# Altium project Assembly Guide.PrjPCB
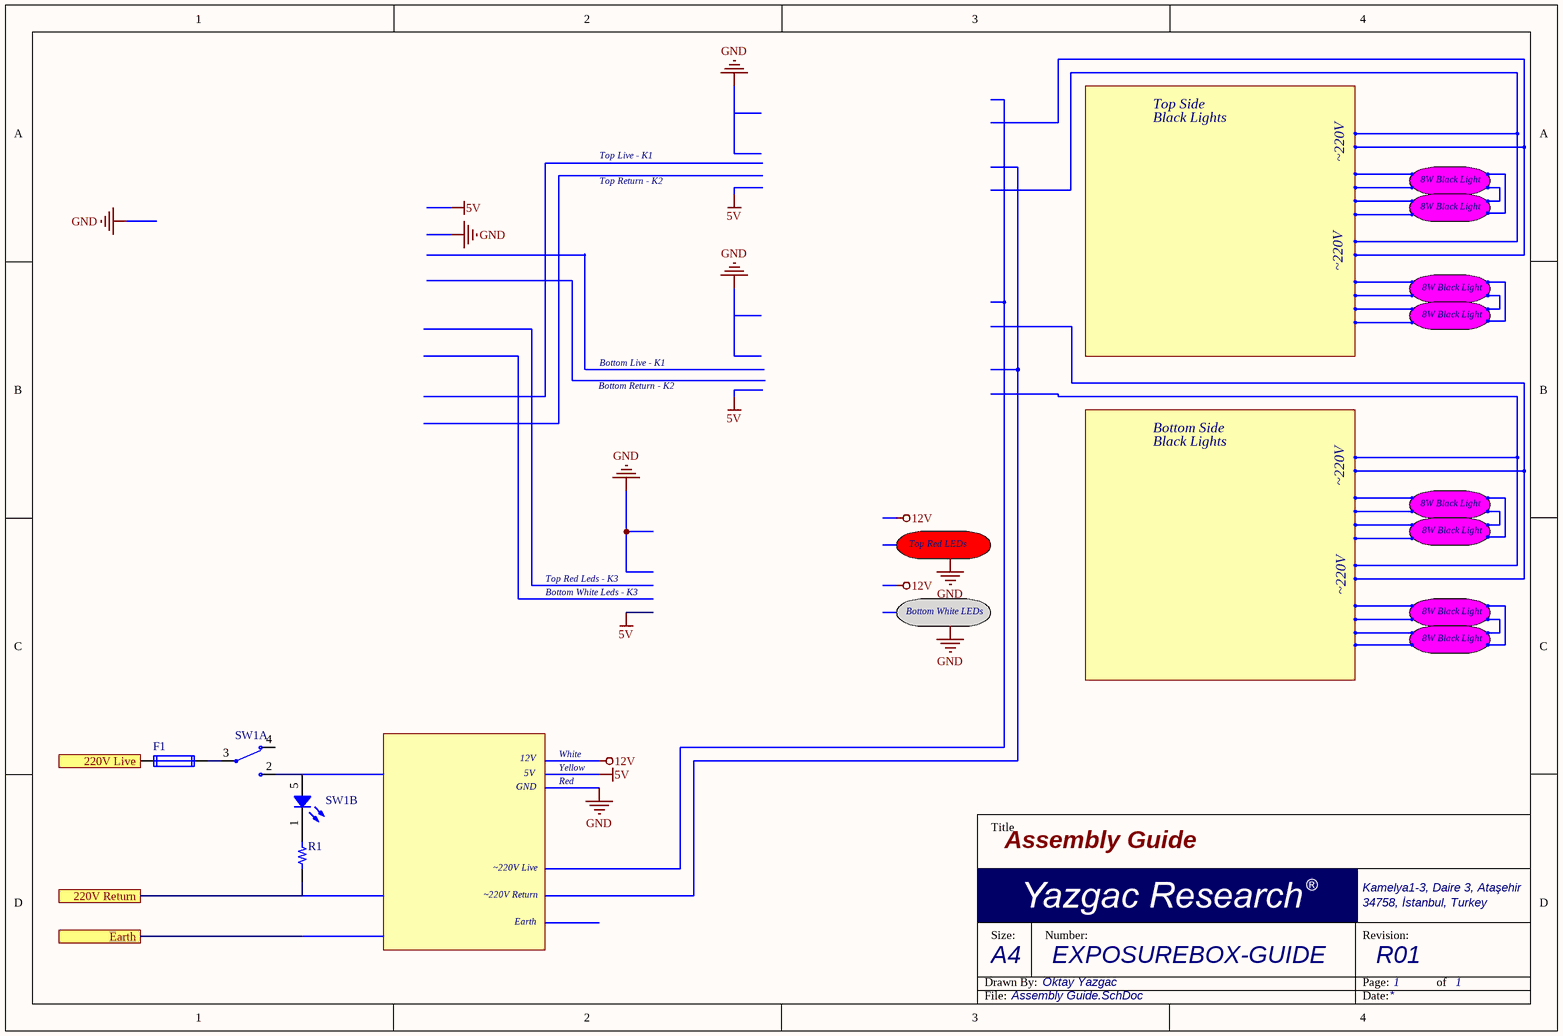
[diagram p0: Assembly Guide.SchDoc]
1 sheet, 3 parts. Net scope: flat (ports and power ports of the same name join across sheets).

## Sheet Assembly Guide.SchDoc: Assembly Guide
size A4; DrawnBy: Oktay Yazgac; Organization: Yazgac Research; Address1: Kamelya1-3, Daire 3, Ataşehir; Address2: 34758, İstanbul, Turkey; DocumentNumber: EXPOSUREBOX-GUIDE; Revision: R01; Page: 1; PageTotal: 1

### Parts
F1  (no value)  [FH-100]
R1  (no value)  [RES 1206/3216]
SW1  (no value)  [C&K ELUMOASAQ2C12]  (parts A,B of 2)

### Ports
220V Live, 220V Return, Earth

### Nets
NetF1_1: F1.1 ; port 220V Live
NetF1_2: F1.2 SW1.3(C)
NetR1_2: R1.2 ; port 220V Return
NetSW1_2: SW1.2(NO) SW1.5(A)

Not connected (* = marked no-connect by the designer): R1 1; SW1 1(C) 4(NC)

### Notes on the sheet
- Top Side
- Top Live - K1
- Black Lights
- ~220V
- 8W Black Light
- Top Return - K2
- Bottom Live - K1
- Bottom Return - K2
- Bottom Side
- Top Red Leds - K3
- Top Red LEDs
- Bottom White Leds - K3
- Bottom White LEDs
- GND
- 12V
- 5V
- White
- Yellow
- Red
- ~220V Return
- ~220V Live
- Earth
- Labels drawn without touching a wire or pin: 5V, 12V, GND
- Title
- Drawn By:
- Size:
- A4
- Number:
- Revision:
- Page:
- of
- File:
- Date:

### Library data of the parts
F1 = Fuse: Fuse & Clips; Published: 8-Jun-2000; LatestRevisionDate: 17-Jul-2002; LatestRevisionNote: Re-released for DXP Platform.; PackageReference: PIN-W2/E2.8; Publisher: Altium Limited; PackageDescription: Thru-Hole; 2 Leads
R1 = Resistor: SMT Resistor; Value: 1K
SW1 = PushButton C&K ELUMOASAQ2C12